# Altium schematic sheet AD603.SchDoc
size A4
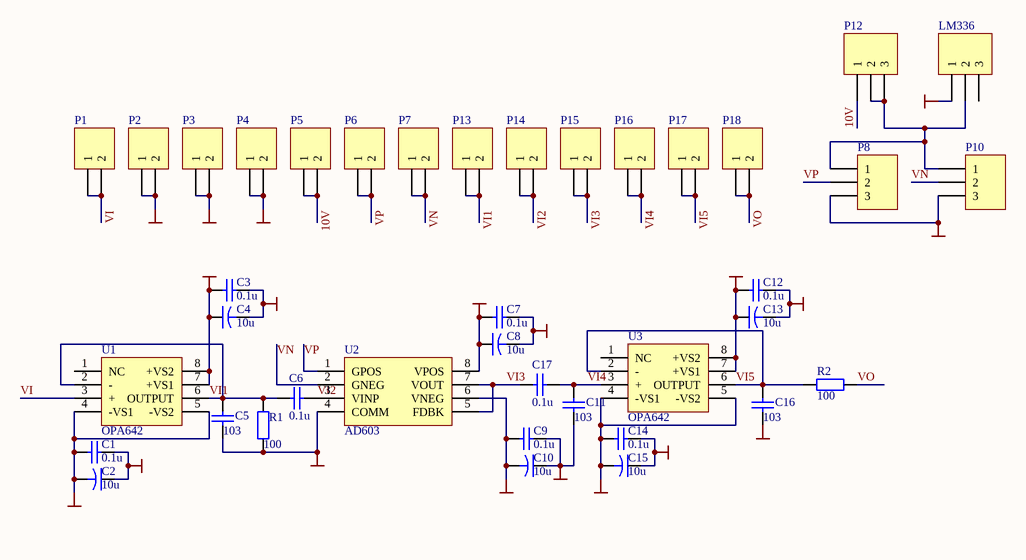
[diagram p0: AD603.SchDoc]

## Parts
C1  value 0.1u  [CC2012-0805]
C2  value 10u  [CR3225-1210]
C3  value 0.1u  [CR3225-1210]
C4  value 10u  [CC2012-0805]
C5  value 103  [CC2012-0805]
C6  value 0.1u  [CC2012-0805]
C7  value 0.1u  [CR3225-1210]
C8  value 10u  [CC2012-0805]
C9  value 0.1u  [CR3225-1210]
C10  value 10u  [CC2012-0805]
C11  value 103  [CC2012-0805]
C12  value 0.1u  [CC3216-1206]
C13  value 10u  [CC2012-0805]
C14  value 0.1u  [CC2012-0805]
C15  value 10u  [CR3225-1210]
C16  value 103  [CC2012-0805]
C17  value 0.1u  [CC2012-0805]
LM336  (no value)  [HDR1X3]
P1  (no value)  [HDR1X2]
P2  (no value)  [HDR1X2]
P3  (no value)  [HDR1X2]
P4  (no value)  [HDR1X2]
P5  (no value)  [HDR1X2]
P6  (no value)  [HDR1X2]
P7  (no value)  [HDR1X2]
P8  (no value)  [HDR1X3]
P10  (no value)  [HDR1X3]
P12  (no value)  [HDR1X3]
P13  (no value)  [HDR1X2]
P14  (no value)  [HDR1X2]
P15  (no value)  [HDR1X2]
P16  (no value)  [HDR1X2]
P17  (no value)  [HDR1X2]
P18  (no value)  [HDR1X2]
R1  value 100  [CC3216-1206]
R2  value 100  [CC3216-1206]
U1  OPA642  [DIP-8]
U2  AD603  [SO-8]
U3  OPA642  [DIP-8]

## Nets
GND: C1.1 C2.1 C3.2 C4.2 C5.1 C7.2 C8.2 C9.1 C10.1 C11.1 C12.2 C13.2 C14.1 C15.1 C16.1 LM336.1 P4.1 P4.2 P8.3 P10.3 R1.2 U2.4(COMM)
VCC: C3.1 C4.1 C7.1 C8.1 C12.1 C13.1 P3.1 P3.2 U1.7(+VS1) U1.8(+VS2) U2.8(VPOS) U3.7(+VS1) U3.8(+VS2)
VEE: C1.2 C2.2 C9.2 C10.2 C14.2 C15.2 P2.1 P2.2 U1.4(-VS1) U1.5(-VS2) U2.6(VNEG) U3.4(-VS1) U3.5(-VS2)
10V: P5.1 P5.2 P12.1
VI: P1.1 P1.2 U1.3(+)
VI1: C5.2 C6.1 P13.1 P13.2 R1.1 U1.2(-) U1.6(OUTPUT)
VI2: C6.2 P14.1 P14.2 U2.3(VINP)
VI3: C17.1 P15.1 P15.2 U2.5(FDBK) U2.7(VOUT)
VI4: C11.2 C17.2 P16.1 P16.2 U3.3(+)
VI5: C16.2 P17.1 P17.2 R2.1 U3.2(-) U3.6(OUTPUT)
VN: P7.1 P7.2 P10.2 U2.2(GNEG)
VO: P18.1 P18.2 R2.2
VP: P6.1 P6.2 P8.2 U2.1(GPOS)
NetLM336_2: LM336.2 P8.1 P10.1 P12.2 P12.3

Not connected (* = marked no-connect by the designer): LM336 3; U1 1(NC); U3 1(NC)

## Library data of the parts
C1 C3 C6 C7 C9 C12 C14 C17 = Cap Semi: Capacitor (Semiconductor SIM Model); Published: 8-Jun-2000; LatestRevisionDate: 17-Jul-2002; LatestRevisionNote: Re-released for DXP Platform.; PackageReference: C1206; Publisher: Altium Limited
C2 C4 C8 C10 C13 C15 = Cap2: Capacitor; Published: 23-Sep-2002; Publisher: Altium Limited
C5 C11 C16 = Cap: Capacitor; Published: 8-Jun-2000; LatestRevisionDate: 17-Jul-2002; LatestRevisionNote: Re-released for DXP Platform.; Publisher: Altium Limited
LM336 P8 P10 P12 = Header 3: Header, 3-Pin; LatestRevisionDate: 17-Jul-2002; LatestRevisionNote: Re-released for DXP Platform.; Publisher: Altium Limited
P1-P7 = Header 2: Header, 2-Pin; LatestRevisionDate: 17-Jul-2002; LatestRevisionNote: Re-released for DXP Platform.; Publisher: Altium Limited
P13-P18 = Header 2H: Header, 2-Pin, Right Angle; LatestRevisionDate: 17-Jul-2002; LatestRevisionNote: Re-released for DXP Platform.; Publisher: Altium Limited
R1 R2 = Res2: Resistor; Published: 8-Jun-2000; LatestRevisionDate: 17-Jul-2002; LatestRevisionNote: Re-released for DXP Platform.; Publisher: Altium Limited